# EasyEDA Pro project schematic.epro

# Schematic Business Card
Create Date: 2024-07-06; Page Name: NFC, LED; Project Name: Business Card; Schematic Name: Business Card; Update Date: 2024-07-06; Company: MCPE_PC; Drawn: EasyEDA; Page Size: A4; Reviewed: EasyEDA; Version: v0.1
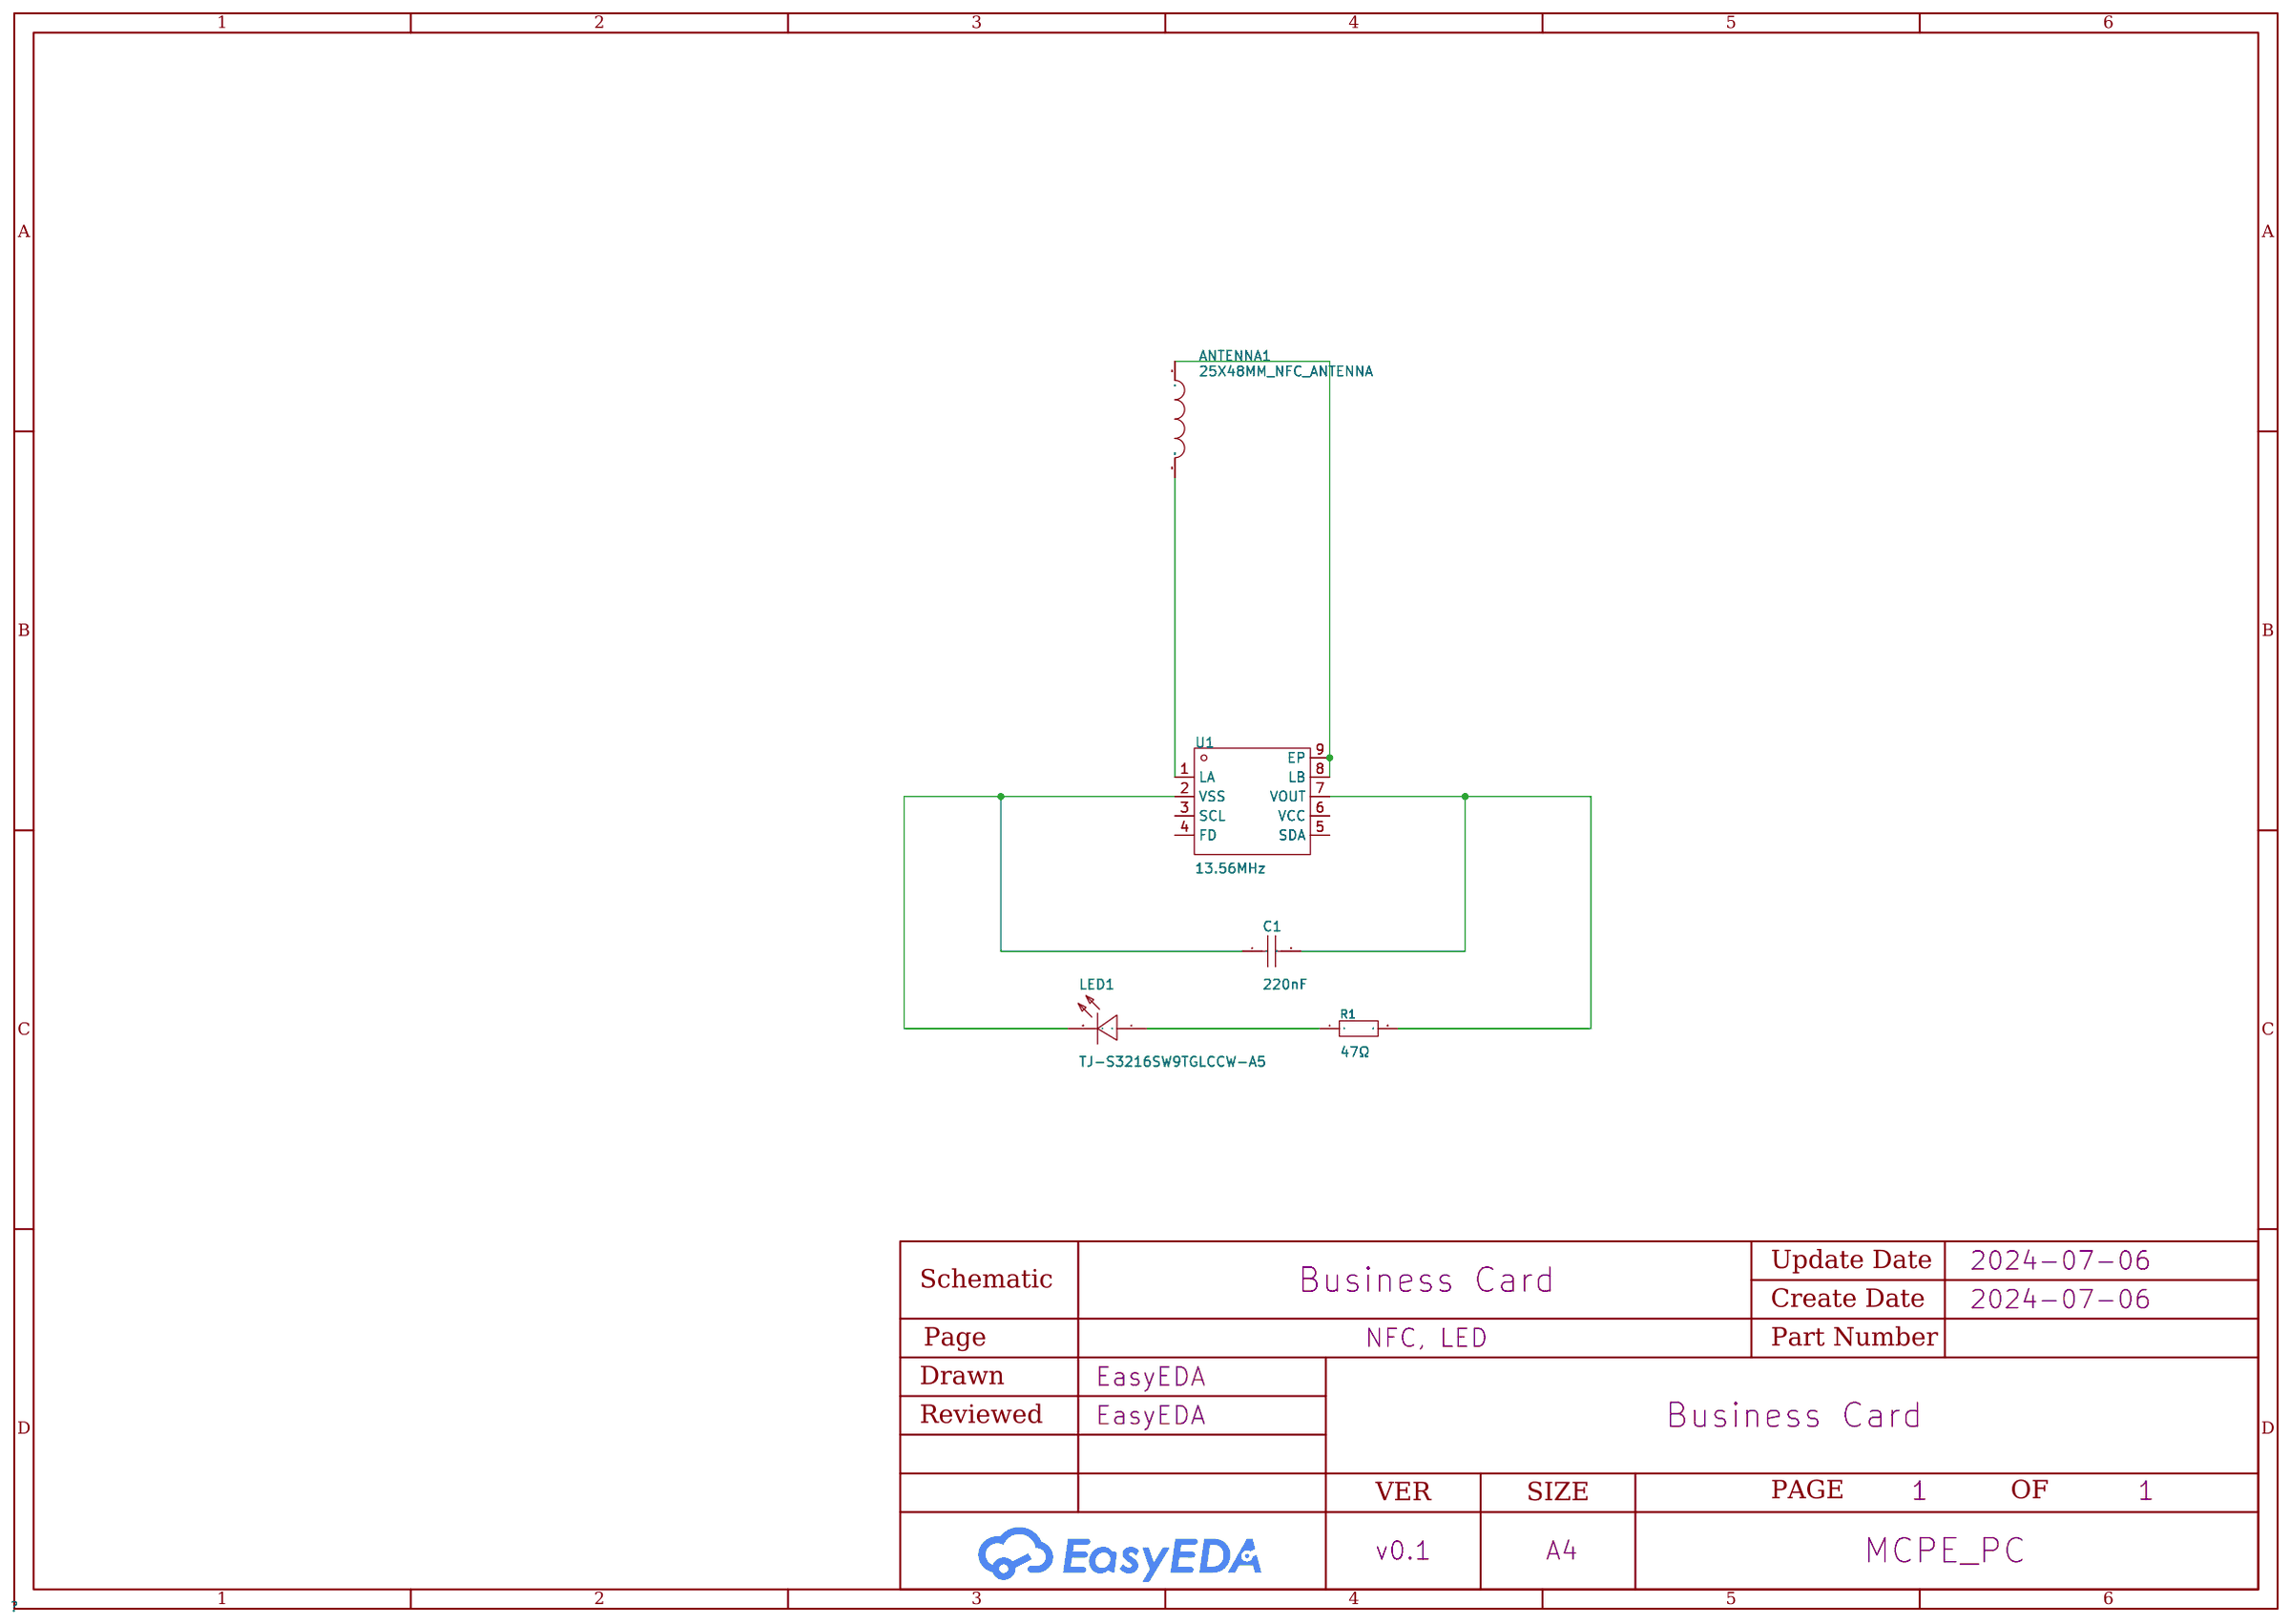
[diagram p0: schematic sheet]

## Parts
ANTENNA1  25X48MM_NFC_ANTENNA  [25X48MM_NFC_ANTENNA]
C1  220nF  [C0603]
LED1  TJ-S3216SW9TGLCCW-A5  [LED1206-R-RD_WHITE]
R1  47Ω  [R0603]
U1  13.56MHz  [XQFN-8_L1.6-W1.6-P0.50-BL]

## Library data of the parts
ANTENNA1 = 25X48MM_NFC_ANTENNA
C1 = CL10B224KA8NNNC: Capacitance: Tolerance:±10% Tolerance:±10% Voltage Rated: Temperature Coefficient:; LCSC Part Name: 220nF ±10% 25V; Supplier Part: C21120; Manufacturer: SAMSUNG(三星); Supplier Footprint: 0603; JLCPCB Part Class: Basic Part; Datasheet: https://atta.szlcsc.com/upload/public/pdf/source/20160218/1457707763339.pdf; Supplier: LCSC; Tolerance: ±10%
LED1 = TJ-S3216SW9TGLCCW-A5: Emitted Color:White Power Dissipation:108mW Forward Current:20mA Dominant Wavelength:- Dominant Wavelength:- Peak Wavelength:- Diode Configuration:- Lens Color:雾状黄透镜 Color Temperature:- Color Temperature:- Viewing Angle:120° Mounting Sytle:- Operating Tem; LCSC Part Name: 白灯; Supplier Part: C192680; Manufacturer: TOGIALED(统佳); Supplier Footprint: 1206; JLCPCB Part Class: Extended Part; Datasheet: https://atta.szlcsc.com/upload/public/pdf/source/20180604/C192680_735B467B4DB8F2AEEA9DA77349F52B9D.pdf; Supplier: LCSC; Emitted Color: White; Power Dissipation: 108mW; Forward Current: 20mA; Lens Color: 雾状黄透镜; Viewing Angle: 120°; Operating Temperature: -40℃~+80℃
R1 = 0603WAF470JT5E: Type:Thick Film Resistors Resistance:47Ω Tolerance:±1% Tolerance:±1% Power(Watts): Overload Voltage (Max): Temperature Coefficient:±100ppm/℃ Temperature Coefficient:±100ppm/℃ Operating Temperature Range:-55℃~+155℃ Operating Temperature Range:-55℃~+155℃; LCSC Part Name: 47Ω ±1% 100mW 厚膜电阻; Supplier Part: C23182; Manufacturer: UNI-ROYAL(厚声); Supplier Footprint: 0603; JLCPCB Part Class: Basic Part; Datasheet: https://atta.szlcsc.com/upload/public/pdf/source/20200306/C422600_1E6D84923E4A46A82E41ADD87F860B5C.pdf; Supplier: LCSC; Type: Thick Film Resistors; Tolerance: ±1%; Temperature Coefficient: ±100ppm/℃; Operating Temperature Range: -55℃~+155℃
U1 = NT3H2111W0FHKH: agreement:ISO 14443 interface type:I2C Frequency:13.56MHz Frequency:13.56MHz mains input:3.3V mains input:3.3V; Supplier Part: C710403; Manufacturer: NXP(恩智浦); Supplier Footprint: XQFN-8(1.6x1.6); JLCPCB Part Class: Extended Part; Datasheet: https://atta.szlcsc.com/upload/public/pdf/source/20231222/0CA007C5B9F698A9424BFDC383BAA79D.pdf; Supplier: LCSC; agreement: ISO 14443; interface type: I2C; mains input: 3.3V

## Nets
Net-(ANTENNA1-P$1): ANTENNA1.P$1 U1.8(LB) U1.9(EP)
Net-(ANTENNA1-P$2): ANTENNA1.P$2 U1.1(LA)
Net-(C1-1): C1.1 LED1.2(K) U1.2(VSS)
Net-(C1-2): C1.2 R1.2 U1.7(VOUT)
Net-(LED1-1): LED1.1(A) R1.1

Not connected (* = marked no-connect by the designer): U1 3(SCL) 4(FD) 5(SDA) 6(VCC)
